# Altium schematic sheet Micro.SchDoc
size A; SheetNumber: 3; SheetTotal: 6
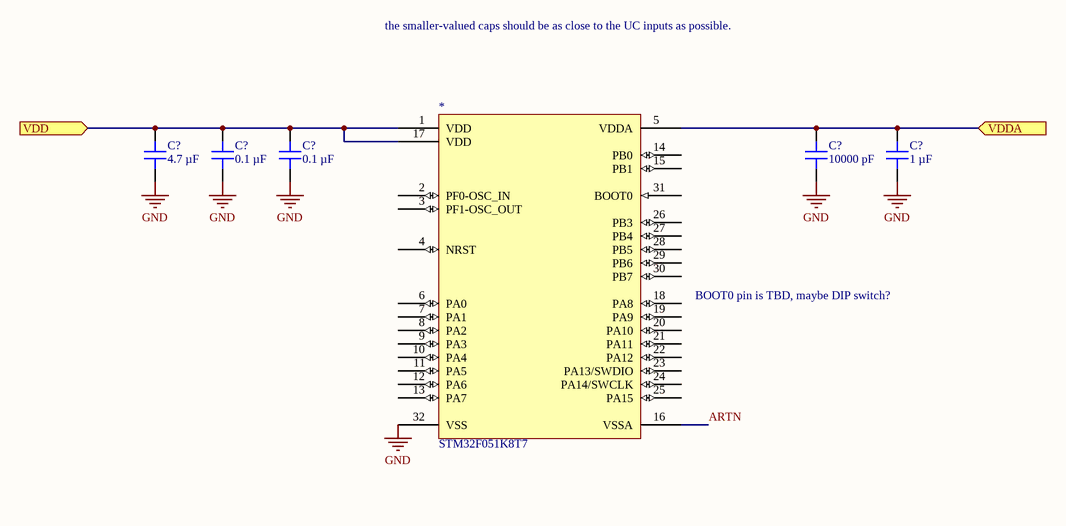
[diagram p0: Micro.SchDoc]

## Parts
(Parts that share a designator on the sheet are numbered #1, #2 ... from top to bottom, then left to right.)
*  STM32F051K8T7  [QFP80P900X900X160-32N]
C?#1  4.7 µF  [CAP 1206_3216 - 0.8MM]
C?#2  0.1 µF  [CAP 0805_2012]
C?#3  0.1 µF  [CAP 0805_2012]
C?#4  10000 pF  [CAP 0805_2012]
C?#5  1 µF  [CAP 0805_2012]

## Ports
VDD (in), VDDA (in)

## Nets
GND: *.32(VSS) C?#1.1 C?#2.1 C?#3.1 C?#4.1 C?#5.1
ARTN: *.16(VSSA)
VDD: *.1(VDD) *.17(VDD) C?#1.2 C?#2.2 C?#3.2 ; port VDD
VDDA: *.5(VDDA) C?#4.2 C?#5.2 ; port VDDA

Not connected (* = marked no-connect by the designer): * 2(PF0-OSC_IN) 3(PF1-OSC_OUT) 4(NRST) 6(PA0) 7(PA1) 8(PA2) 9(PA3) 10(PA4) 11(PA5) 12(PA6) 13(PA7) 14(PB0) 15(PB1) 18(PA8) 19(PA9) 20(PA10) 21(PA11) 22(PA12) 23(PA13/SWDIO) 24(PA14/SWCLK) 25(PA15) 26(PB3) 27(PB4) 28(PB5) 29(PB6) 30(PB7) 31(BOOT0)

## Notes on the sheet
- the smaller-valued caps should be as close to the UC inputs as possible.
- BOOT0 pin is TBD, maybe DIP switch?

## Library data of the parts
C?#1 = C1206C475M3RAC7800: CAP CER 4.7UF 25V X7R 1206; manufacturer: KEMET; Tolerance: ±20%; Part Number: C1206C475M3RAC7800; Value: 4.7 µF; Applications: Bypass, Decoupling; Capacitance: 4.7 µF; componentlink1description: Datasheet; componentlink1url: https://api.kemet.com/component-edge/download/datasheet/C1206C475M3RACTU.pdf; componentlink2description: DigiKey Link; componentlink2url: https://www.digikey.com/en/products/detail/kemet/C1206C475M3RAC7800/2215998; Device Package: 1206 (3216 Metric); lastupdated: 8/22/2023 7:13:55 PM; Lifecycle Status: Active; Minimum Order: 1; Mounting Type: Surface Mount, MLCC; Operating Temperature: -55°C ~ 125°C; Package / Case: 1206 (3216 Metric); packaging: TapeAndReel; partid: 30483; Part Status: Active; price: 0.07; series: SMD Comm X7R; Size / Dimension: 0.126" L x 0.063" W (3.20mm x 1.60mm); Supplier 1: DigiKey; Supplier Part Number 1: 399-C1206C475M3RAC7800CT-ND; Temperature Coefficient: X7R; Thickness (Max): 0.071" (1.80mm); Voltage - Rated: 25V
C?#2 C?#3 = C0805C104M3RAC7800: CAP CER 0.1UF 25V X7R 0805; manufacturer: KEMET; Tolerance: ±20%; Part Number: C0805C104M3RAC7800; Value: 0.1 µF; Applications: Bypass, Decoupling; Capacitance: 0.1 µF; componentlink1description: Datasheet; componentlink1url: https://api.kemet.com/component-edge/download/datasheet/C0805C104M3RACTU.pdf; componentlink2description: DigiKey Link; componentlink2url: https://www.digikey.com/en/products/detail/kemet/C0805C104M3RAC7800/2211748; Device Package: 0805 (2012 Metric); lastupdated: 8/21/2023 7:11:38 PM; Lifecycle Status: Active; Minimum Order: 1; Mounting Type: Surface Mount, MLCC; Operating Temperature: -55°C ~ 125°C; Package / Case: 0805 (2012 Metric); packaging: TapeAndReel; partid: 32959; Part Status: Active; price: 0.01; series: SMD Comm X7R; Size / Dimension: 0.079" L x 0.049" W (2.00mm x 1.25mm); Supplier 1: DigiKey; Supplier Part Number 1: 399-C0805C104M3RAC7800CT-ND; Temperature Coefficient: X7R; Thickness (Max): 0.035" (0.88mm); Voltage - Rated: 25V
C?#4 = C0805C103M3RAC7800: CAP CER 10000PF 25V X7R 0805; manufacturer: KEMET; Tolerance: ±20%; Part Number: C0805C103M3RAC7800; Value: 10000 pF; Applications: Bypass, Decoupling; Capacitance: 10000 pF; componentlink1description: Datasheet; componentlink1url: https://api.kemet.com/component-edge/download/datasheet/C0805C103M3RACTU.pdf; componentlink2description: DigiKey Link; componentlink2url: https://www.digikey.com/en/products/detail/kemet/C0805C103M3RAC7800/2211730; Device Package: 0805 (2012 Metric); lastupdated: 8/21/2023 7:11:36 PM; Lifecycle Status: Active; Minimum Order: 1; Mounting Type: Surface Mount, MLCC; Operating Temperature: -55°C ~ 125°C; Package / Case: 0805 (2012 Metric); packaging: TapeAndReel; partid: 31983; Part Status: Active; price: 0.02; series: SMD Comm X7R; Size / Dimension: 0.079" L x 0.049" W (2.00mm x 1.25mm); Supplier 1: DigiKey; Supplier Part Number 1: 399-C0805C103M3RAC7800CT-ND; Temperature Coefficient: X7R; Thickness (Max): 0.035" (0.88mm); Voltage - Rated: 25V
C?#5 = C0805C105M3RAC7800: CAP CER 1UF 25V X7R 0805; manufacturer: KEMET; Tolerance: ±20%; Part Number: C0805C105M3RAC7800; Value: 1 µF; Applications: Bypass, Decoupling; Capacitance: 1 µF; componentlink1description: Datasheet; componentlink1url: https://api.kemet.com/component-edge/download/datasheet/C0805C105M3RACTU.pdf; componentlink2description: DigiKey Link; componentlink2url: https://www.digikey.com/en/products/detail/kemet/C0805C105M3RAC7800/2211774; Device Package: 0805 (2012 Metric); lastupdated: 8/21/2023 7:11:38 PM; Lifecycle Status: Active; Minimum Order: 1; Mounting Type: Surface Mount, MLCC; Operating Temperature: -55°C ~ 125°C; Package / Case: 0805 (2012 Metric); packaging: TapeAndReel; partid: 32957; Part Status: Active; price: 0.02; series: SMD Comm X7R; Size / Dimension: 0.079" L x 0.049" W (2.00mm x 1.25mm); Supplier 1: DigiKey; Supplier Part Number 1: 399-C0805C105M3RAC7800CT-ND; Temperature Coefficient: X7R; Thickness (Max): 0.057" (1.45mm); Voltage - Rated: 25V